# EAGLE design IO_v2 (EAGLE 8.5.1)
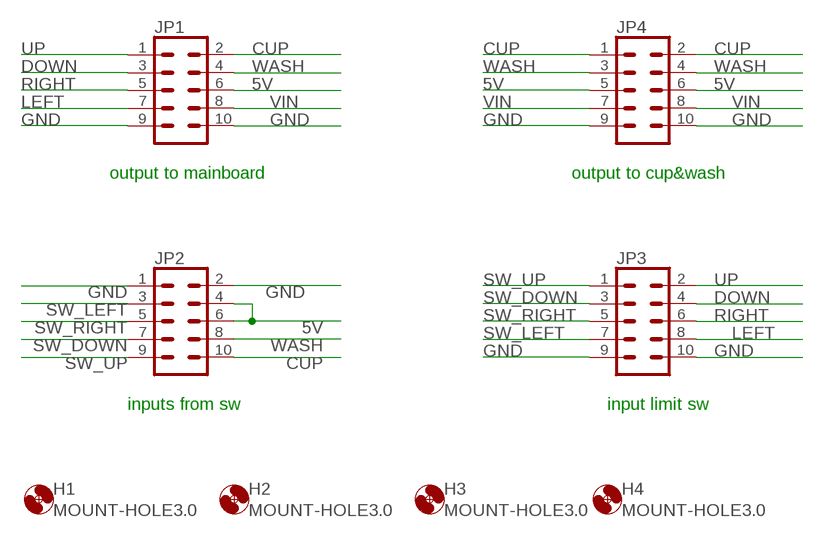
[diagram p0: schematic, sheet 1]

## Parts
H1  MOUNT-HOLE3.0  [3,0]
H2  MOUNT-HOLE3.0  [3,0]
H3  MOUNT-HOLE3.0  [3,0]
H4  MOUNT-HOLE3.0  [3,0]
JP1  CONN_05X2PTH  [2X5]
JP2  CONN_05X2PTH  [2X5]
JP3  CONN_05X2PTH  [2X5]
JP4  CONN_05X2PTH  [2X5]

## Nets
5V: JP1.6 JP2.4 JP2.6 JP4.5 JP4.6
CUP: JP1.2 JP2.10 JP4.1 JP4.2
DOWN: JP1.3 JP3.4
GND: JP1.9 JP1.10 JP2.1 JP2.2 JP3.9 JP3.10 JP4.9 JP4.10
LEFT: JP1.7 JP3.8
RIGHT: JP1.5 JP3.6
SW_DOWN: JP2.7 JP3.3
SW_LEFT: JP2.3 JP3.7
SW_RIGHT: JP2.5 JP3.5
SW_UP: JP2.9 JP3.1
UP: JP1.1 JP3.2
VIN: JP1.8 JP4.7 JP4.8
WASH: JP1.4 JP2.8 JP4.3 JP4.4

## Notes on the sheet
- output to mainboard | output to cup&wash
- inputs from sw | input limit sw

## Library data of the parts
H1-H4 = holes:MOUNT-HOLE: MOUNTING HOLE with drill center marker
JP1-JP4 = SparkFun-Connectors:CONN_05X2: Multi connection point. Often used as Generic Header-pin footprint for 0.1 inch spaced/style header connections For AVR SPI programming port, see special device with nice symbol: "AVR_SPI_PROG_5x2.dev" You can populate with any combo of single row headers, but if you'd like an exact match, check these: 2x5 AVR ICSP Male Header <https://www.sparkfun.com/products/778> (PRT-00778) 2x5 Pin Shrouded Header <https://www.sparkfun.com/products/8506> (PRT-08506) On any of the 0.1 inch spaced packages, you can populate with these: Break Away Headers - Straight <https://www.sparkfun.com/products/116> (PRT-00116) Break Away Male Headers - Right Angle <https://www.sparkfun.com/products/553> (PRT-00553) Female Headers <https://www.sparkfun.com/products/115> (PRT-00115) Break Away Headers - Machine Pin <https://www.sparkfun.com/products/117> (PRT-00117) Break Away Female Headers - Swiss Machine Pin <https://www.sparkfun.com/products/743> (PRT-00743) Special note: the shrouded connector mates well with our 5x2 ribbon cables: 2x5 Pin IDC Ribbon Cable <https://www.sparkfun.com/products/8535> (PRT-08535); PROD_ID: CONN-08499; SF_ID: PRT-0778

## Board
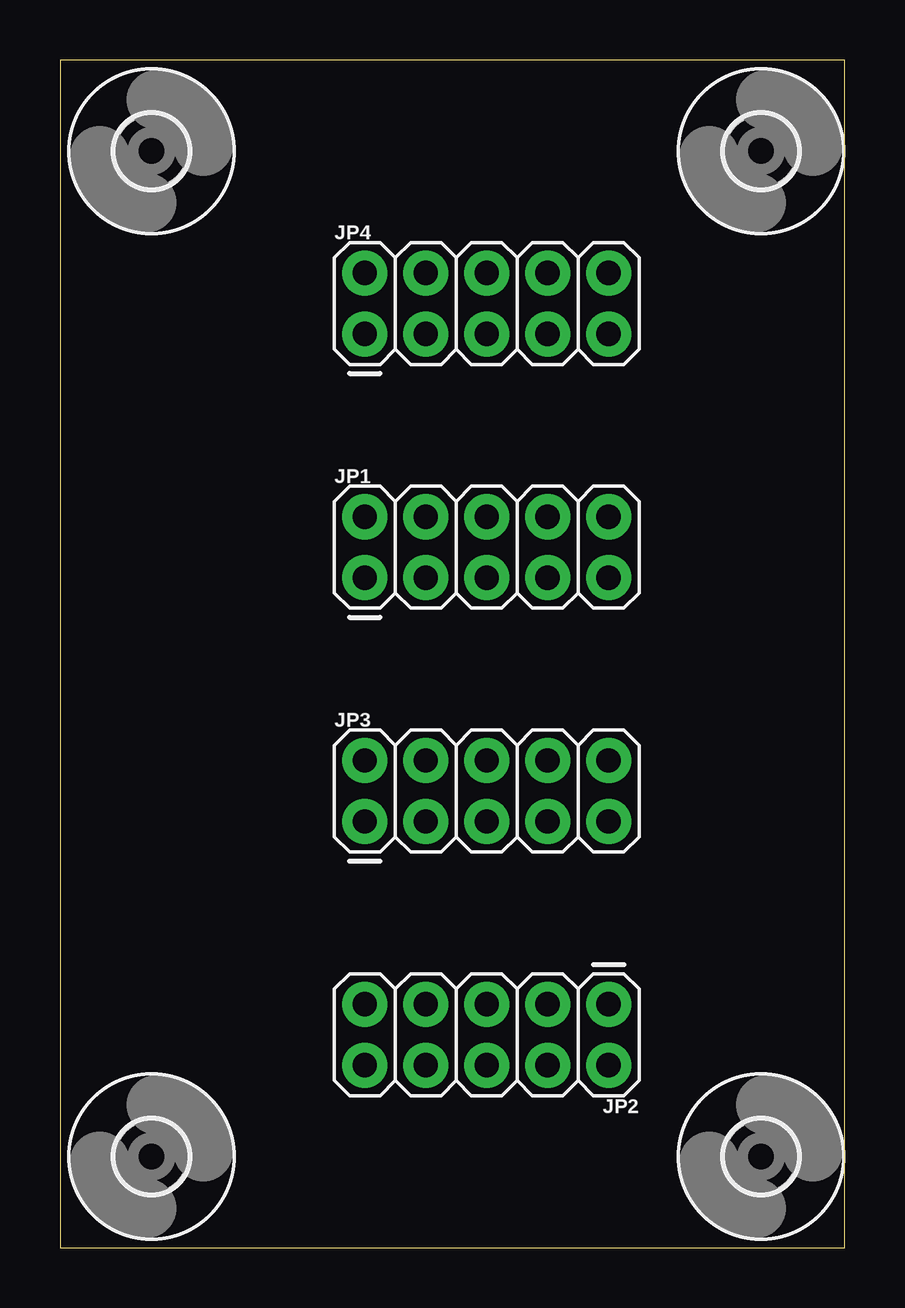
[diagram p1: board, top side]
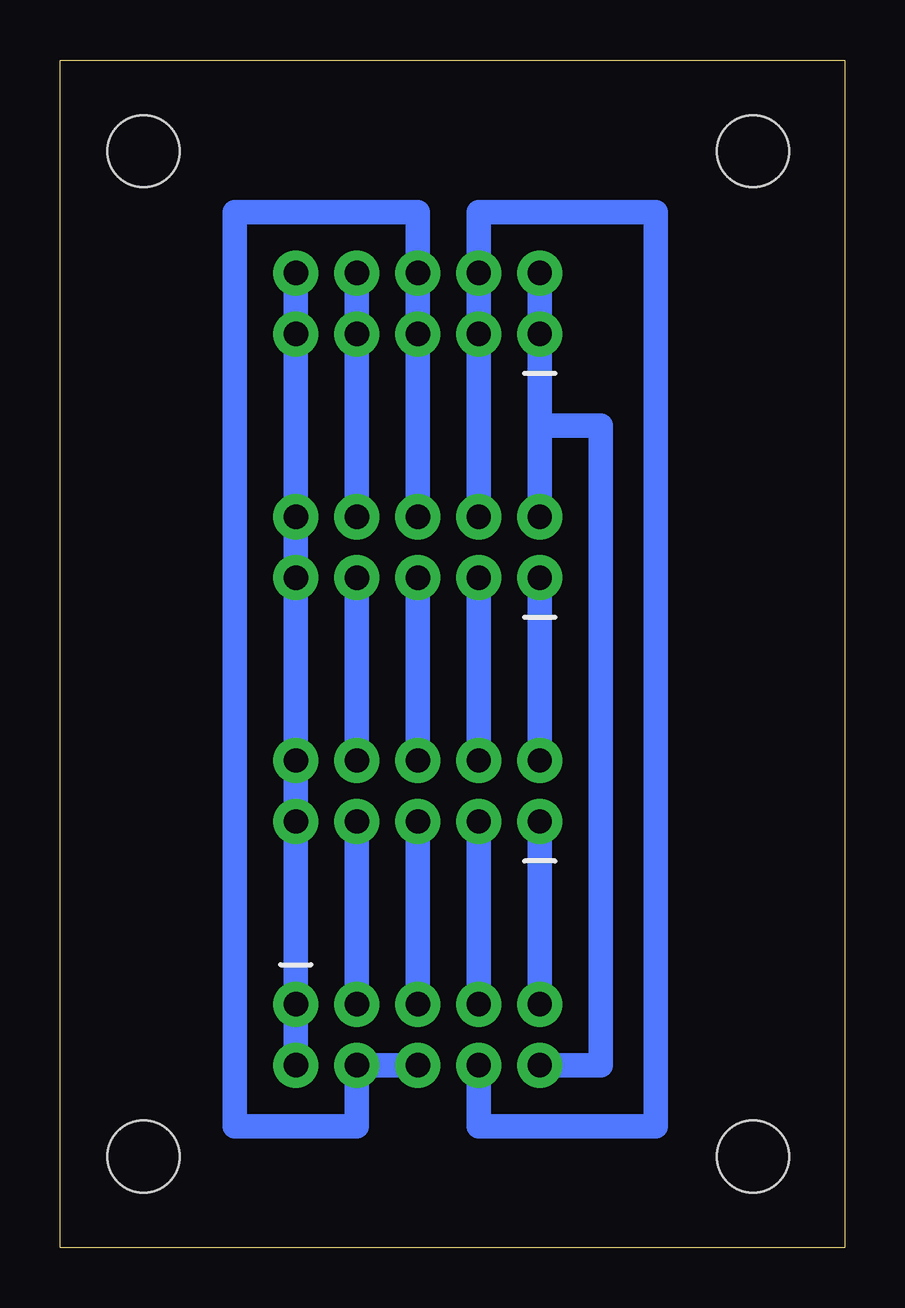
[diagram p2: board, bottom side, seen from below]

Size 32.69 x 49.52 mm. Coordinates in mm from the lower left corner, seen from the top.
Outline: 0,0 32.69,0 32.69,49.52 0,49.52 0,0
Copper layers (1*16): Top 0.035mm / dielectric 1.5mm / Bottom 0.035mm
Design rules "default": minimum track width 6mil, minimum drill 0.35mm, track to track 6mil, track to pad 6mil, pad to pad 6mil, via to via 6mil, smd to smd 6mil, copper to edge 40mil, drill to drill 6mil, minimum pad ring 10mil, minimum via ring 8mil, stop-mask expansion 4mil, vias tented up to drill 0mil, thermal gap 10mil

### Footprints (pad centres in the part's own frame; a part is rotated, then mirrored left to right if it is on the bottom)
3,0 = hole 3: 0,0
2X5 = drill 1.016 pad 1.88: 1 0,0; 2 0,2.54; 3 2.54,0; 4 2.54,2.54; 5 5.08,0; 6 5.08,2.54; 7 7.62,0; 8 7.62,2.54; 9 10.16,0; 10 10.16,2.54

### Placement (x,y rotation side)
H1  3.81,3.81 0 top
H2  29.21,3.81 0 top
H3  29.21,45.72 0 top
H4  3.81,45.72 0 top
JP1  12.7,27.94 0 top
JP2  22.86,10.16 180 top
JP3  12.7,17.78 0 top
JP4  12.7,38.1 0 top

### Tracks (layer width: path | path; a pad name or v marks a point on that pad's centre or on a via)
5V
  Bottom 1.016: JP2.6 JP2.4 20.32,5.08 25.4,5.08 25.4,43.18 17.78,43.18 JP4.6 JP4.5 JP1.6
CUP
  Bottom 1.016: JP4.2 JP4.1 12.7,34.29 | 12.7,34.29 JP1.2 | 12.7,34.29 10.16,34.29 10.16,7.62 JP2.10
DOWN
  Bottom 1.016: JP3.4 JP1.3
GND
  Bottom 1.016: JP2.2 JP2.1 JP3.9 JP3.10 JP1.9 JP1.10 JP4.9 JP4.10
LEFT
  Bottom 1.016: JP1.7 JP3.8
RIGHT
  Bottom 1.016: JP1.5 JP3.6
SW_DOWN
  Bottom 1.016: JP2.7 JP3.3
SW_LEFT
  Bottom 1.016: JP3.7 JP2.3
SW_RIGHT
  Bottom 1.016: JP3.5 JP2.5
SW_UP
  Bottom 1.016: JP3.1 JP2.9
UP
  Bottom 1.016: JP1.1 JP3.2
VIN
  Bottom 1.016: JP4.8 JP4.7 JP1.8
WASH
  Bottom 1.016: JP1.4 JP4.3 JP4.4 15.24,43.18 7.87,43.18 7.87,5.08 15.24,5.08 JP2.8